# EAGLE design MicroMaster (EAGLE 9.6.2)
COMPANY: ADAFRUIT INDUSTRIES; DRAWN: KTOWN; REV: A
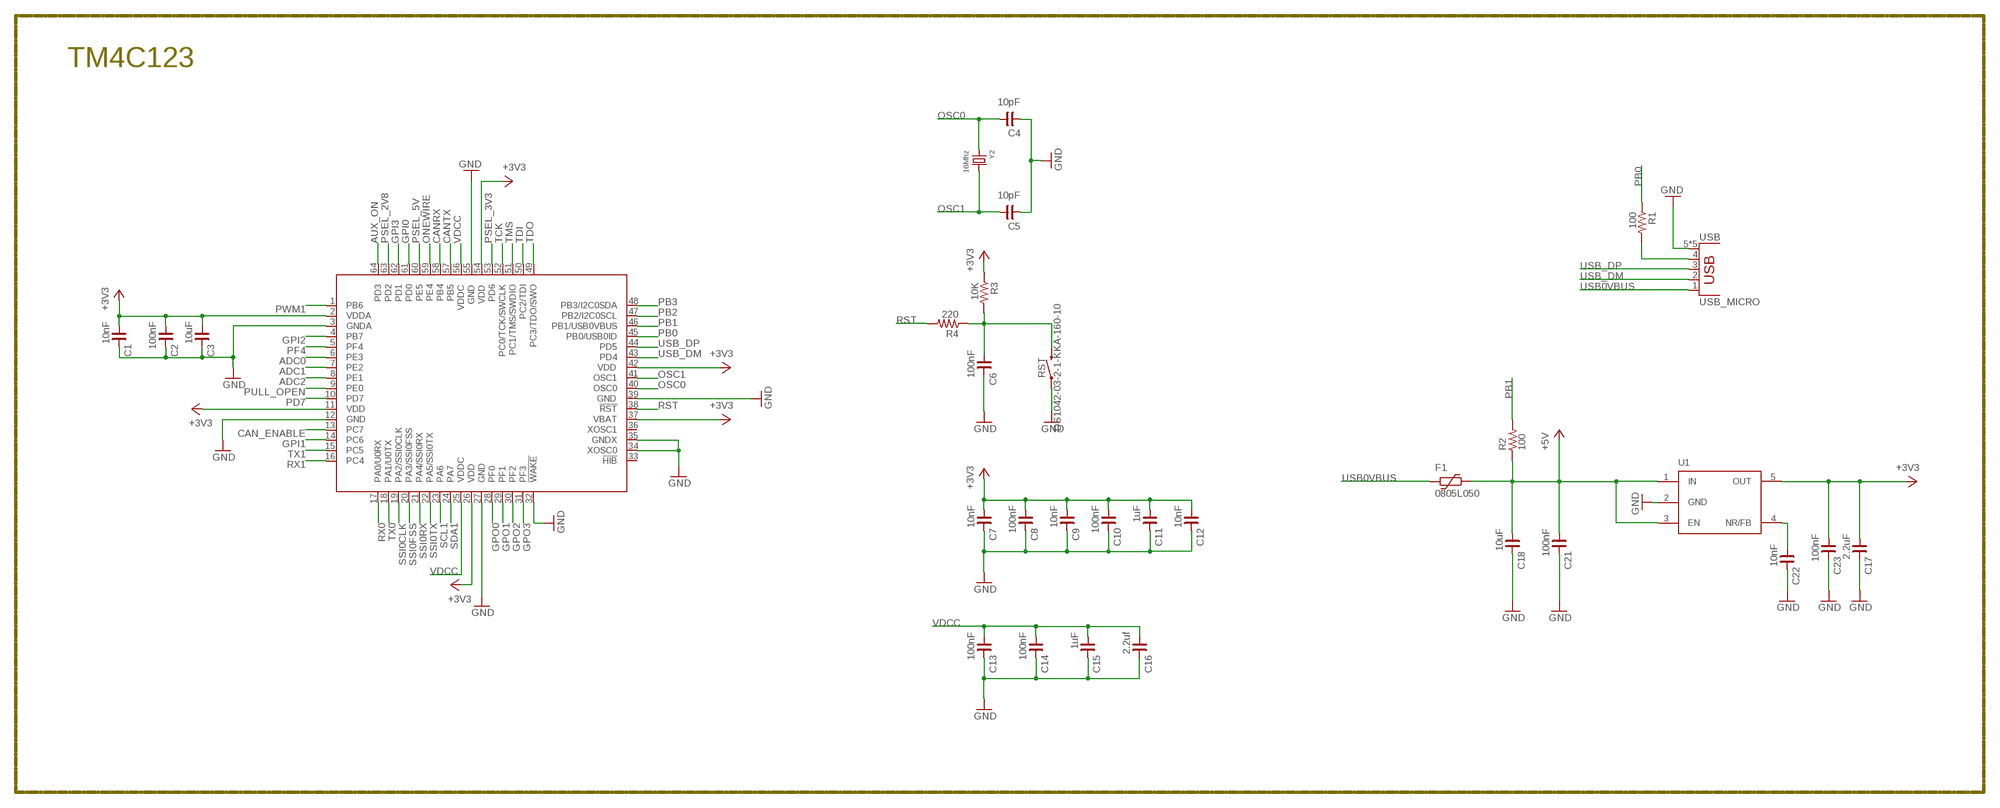
[diagram p0: schematic, sheet 1, part 1 of 3]
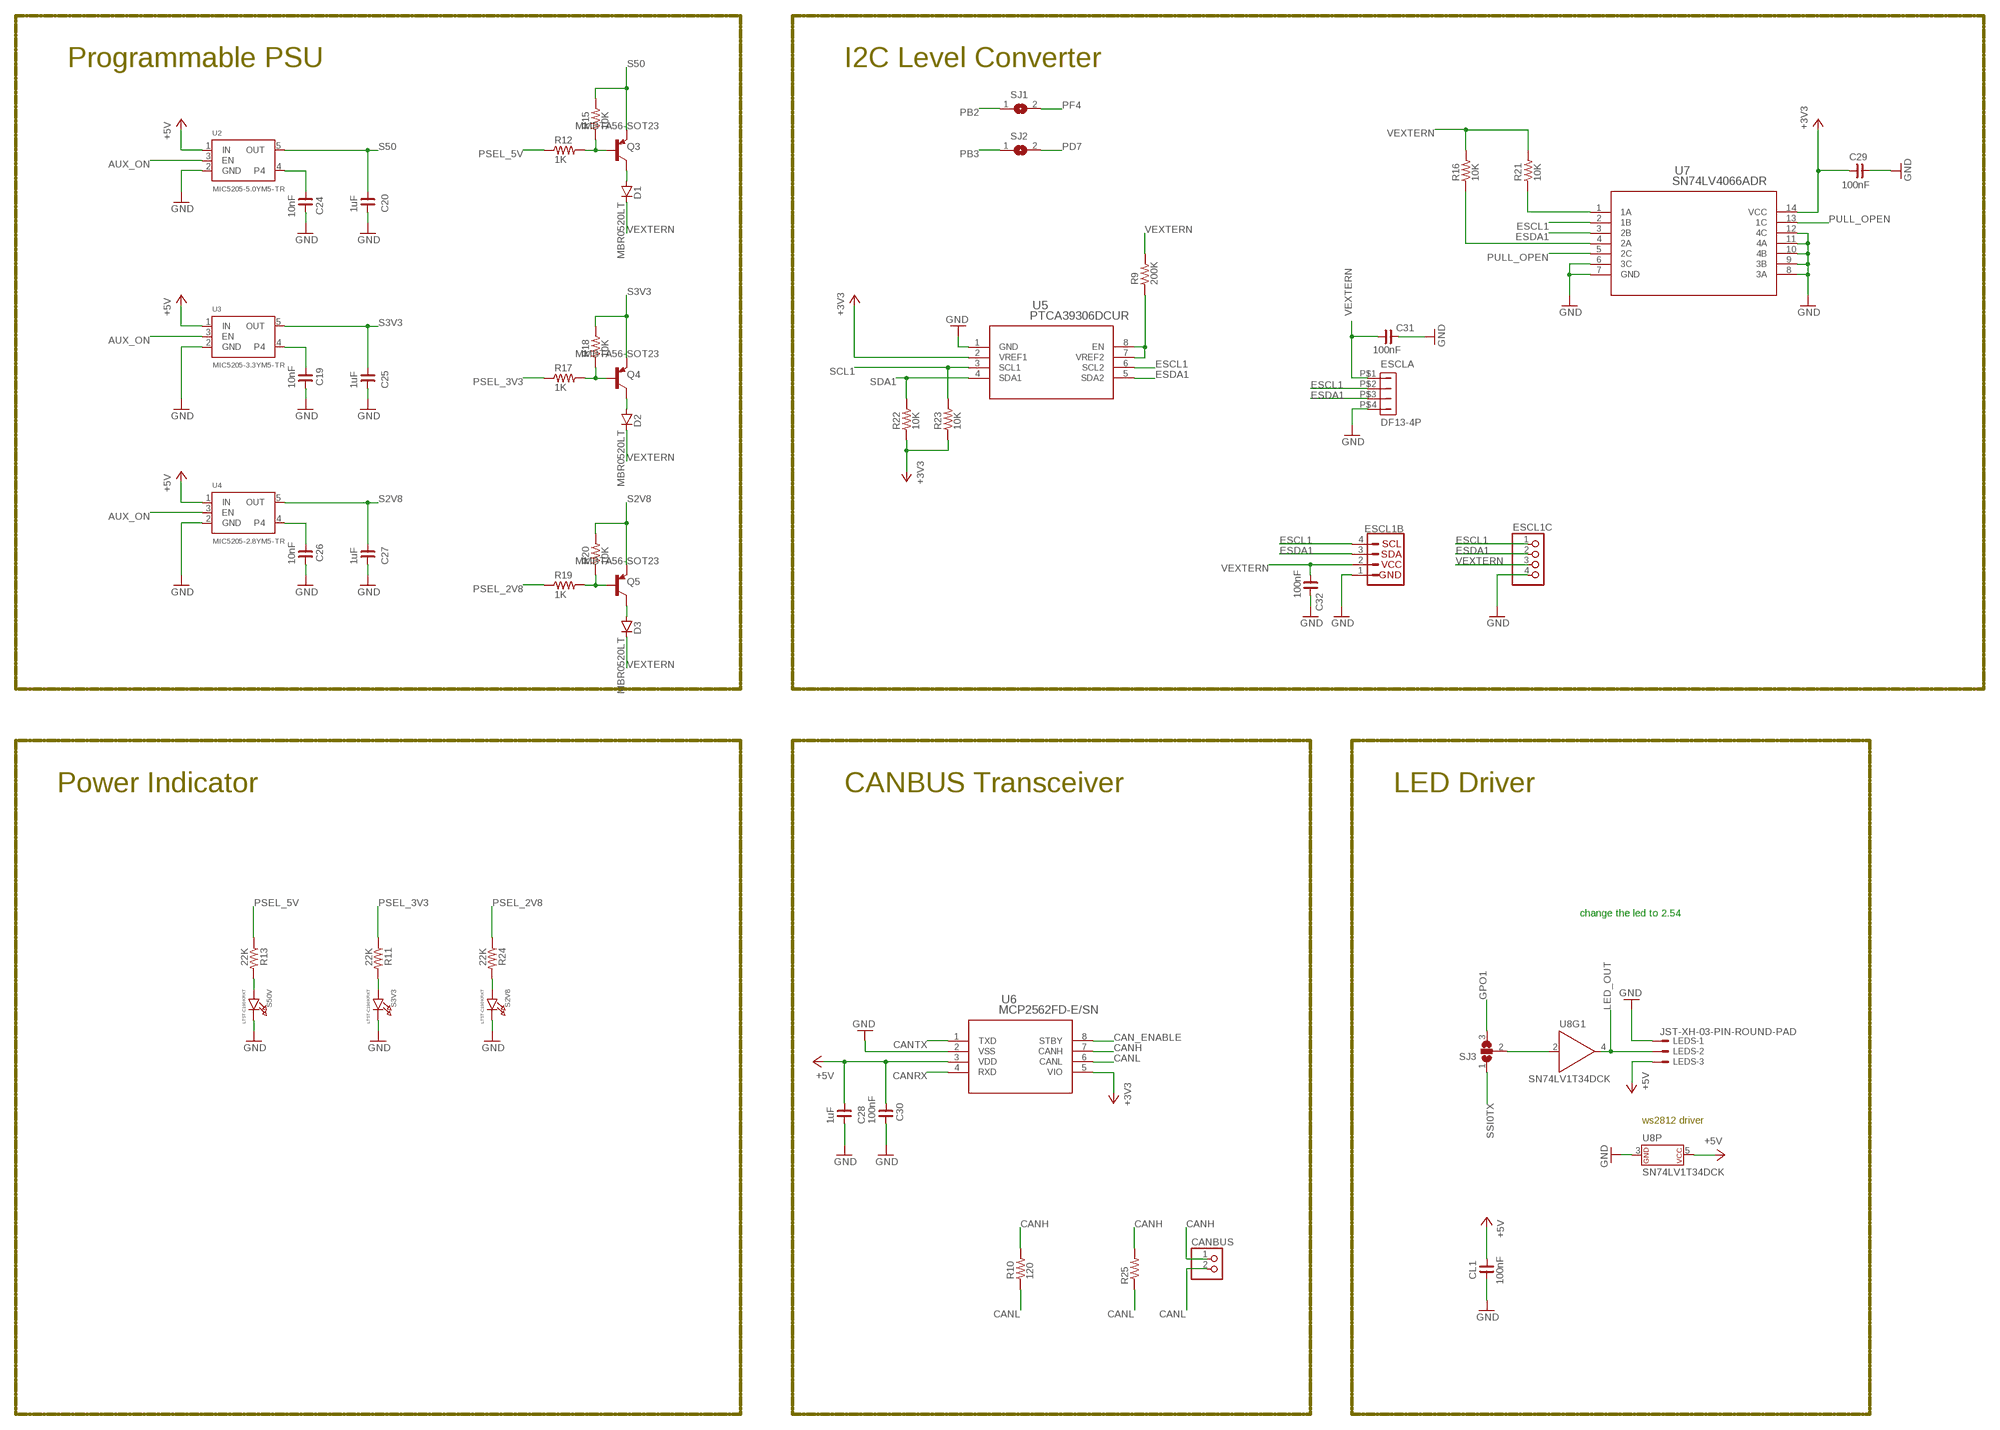
[diagram p1: schematic, sheet 1, part 2 of 3]
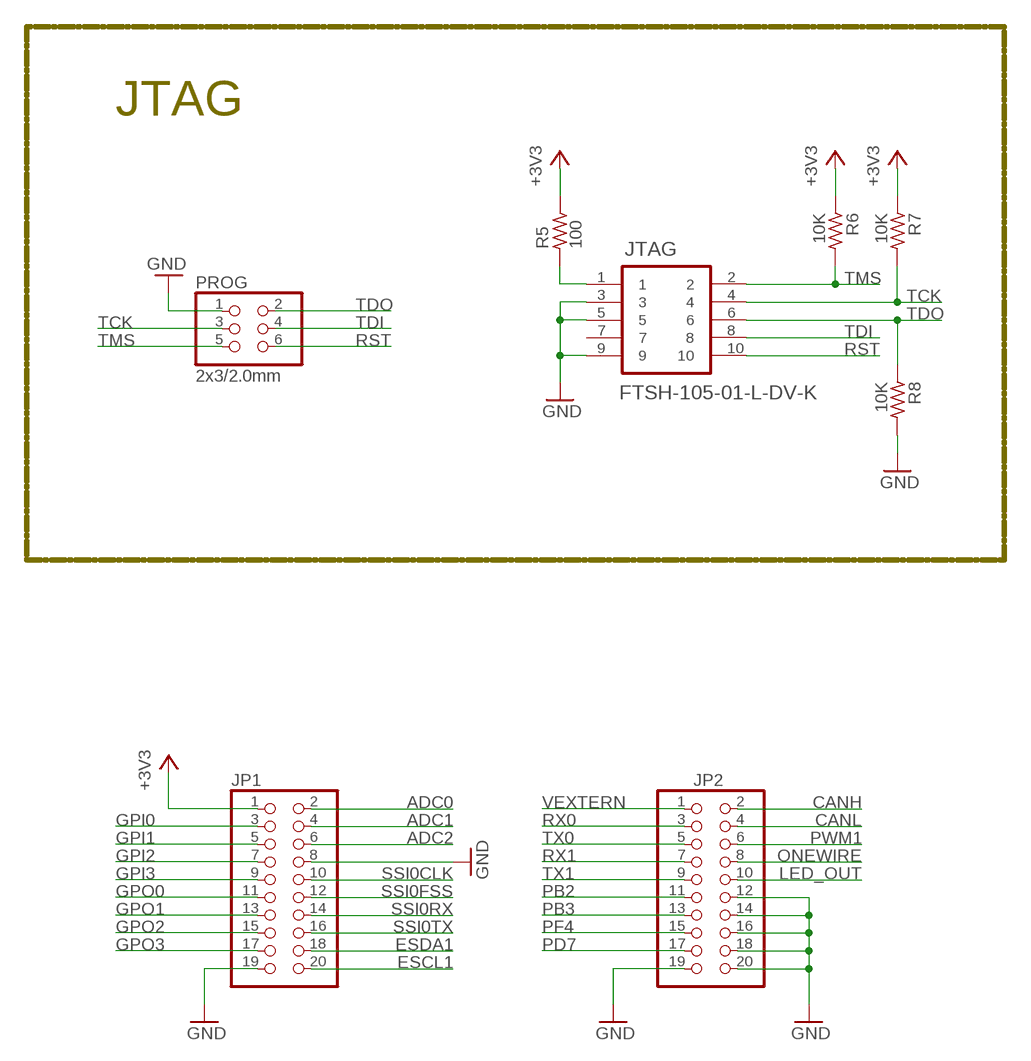
[diagram p2: schematic, sheet 1, part 3 of 3]

## Parts
C1  10nF  C_0402  [C0402]
C2  100nF  C_0402  [C0402]
C3  10uF  C_0603  [C0603]
C4  10pF  C_0402  [C0402]
C5  10pF  C_0402  [C0402]
C6  100nF  C_0402  [C0402]
C7  10nF  C_0402  [C0402]
C8  100nF  C_0402  [C0402]
C9  10nF  C_0402  [C0402]
C10  100nF  C_0402  [C0402]
C11  1uF  C_0402  [C0402]
C12  10nF  C_0402  [C0402]
C13  100nF  C_0402  [C0402]
C14  100nF  C_0402  [C0402]
C15  1uF  C_0402  [C0402]
C16  2.2uf  C_0603  [C0603]
C17  2.2uF  C_0603  [C0603]
C18  10uF  C_0603  [C0603]
C19  10nF  C_0402  [C0402]
C20  1uF  C_0603  [C0603]
C21  100nF  C_0402  [C0402]
C22  10nF  C_0402  [C0402]
C23  100nF  C_0402  [C0402]
C24  10nF  C_0402  [C0402]
C25  1uF  C_0603  [C0603]
C26  10nF  C_0402  [C0402]
C27  1uF  C_0603  [C0603]
C28  1uF  C_0805  [C0805]
C29  100nF  C_0603  [C0603]
C30  100nF  C_0603  [C0603]
C31  100nF  C_0402  [C0402]
C32  100nF  C_0402  [C0402]
CANBUS  PINHD-1X02_2.54-S  [1X02-S]
CL1  100nF  C_0402  [C0402]
D1  MBR0520LT  [SOD123]
D2  MBR0520LT  [SOD123]
D3  MBR0520LT  [SOD123]
ESCL1B  QWIIC_CONNECTORJS-1MM  [1X04_1MM_RA]
ESCL1C  PINHD-1X04_2.54-S  [1X04-S]
ESCLA  DF13-4P  DF13-4P-1.25DSA  [DF13-4P-1.25DSA]
F1  0805L050  [0805L]
IC1  TM4C123[7,G]XXPM  [PM_S-PQFP-G64]
JP1  PINHD-2X10_2.54  [2X10]
JP2  PINHD-2X10_2.54  [2X10]
JTAG  FTSH-105-01-L-DV-K  [SAMTEC_FTSH-105-01-L-DV-K]
LEDS  JST-XH-03-PIN-ROUND-PAD  [JST-XH-03-PACKAGE-ROUND-PAD]
PROG  2x3/2.0mm  PINHD-2X03_2.00  [2X03M]
Q3  MMBTA56-SOT23  [SOT23]
Q4  MMBTA56-SOT23  [SOT23]
Q5  MMBTA56-SOT23  [SOT23]
R1  100  R_0402  [R0402]
R2  100  R_0402  [R0402]
R3  10K  R_0402  [R0402]
R4  220  R_0402  [R0402]
R5  100  R_0402  [R0402]
R6  10K  R_0402  [R0402]
R7  10K  R_0402  [R0402]
R8  10K  R_0402  [R0402]
R9  200K  R_0402  [R0402]
R10  120  R_0603  [R0603]
R11  22K  R_0402  [R0402]
R12  1K  R_0402  [R0402]
R13  22K  R_0402  [R0402]
R15  10K  R_0402  [R0402]
R16  10K  R_0402  [R0402]
R17  1K  R_0402  [R0402]
R18  10K  R_0402  [R0402]
R19  1K  R_0402  [R0402]
R20  10K  R_0402  [R0402]
R21  10K  R_0402  [R0402]
R22  10K  R_0402  [R0402]
R23  10K  R_0402  [R0402]
R24  22K  R_0402  [R0402]
R25  R-US_0204/5  [0204/5]
RST  DS1042-03-2-1-KKA-160-10  DS1042-03-2-1  [DS1042-03-2-1]
S2V8  LTST-C190KRKT  LED0603  [CHIPLED_0603]
S3V3  LTST-C190KRKT  LED0603  [CHIPLED_0603]
S50V  LTST-C190KRKT  LED0603  [CHIPLED_0603]
SJ1  SOLDERJUMPERCLOSED  [SOLDERJUMPER_CLOSEDWIRE]
SJ2  SOLDERJUMPERCLOSED  [SOLDERJUMPER_CLOSEDWIRE]
SJ3  SJ2W  [SJ_2]
U1  TPS73633  [SOT23-5L]
U2  MIC5205-5.0YM5-TR  VREG_SOT23-5  [SOT23-5]
U3  MIC5205-3.3YM5-TR  VREG_SOT23-5  [SOT23-5]
U4  MIC5205-2.8YM5-TR  VREG_SOT23-5  [SOT23-5]
U5  PTCA39306DCUR  [VSSOP8_PTCA39306DCUR_TEX]
U6  MCP2562FD-E/SN  [SOIC8-N_MC_MCH]
U7  SN74LV4066ADR  [D14]
U8  SN74LV1T34DCK  [SC70-5]
USB  USB_MICRO  [USB_MICRO_MOLEX_FULL]
Y2  16Mhz  CRYSTAL.6X3.3MM  [6X3.3MM]

## Nets
+3V3: C1.1 C2.1 C3.1 C7.1 C8.1 C9.1 C10.1 C11.1 C12.1 C17.1 C23.1 C29.1 IC1.2(VDDA) IC1.11(VDD) IC1.26(VDD) IC1.37(VBAT) IC1.42(VDD) IC1.54(VDD) JP1.1 R3.1 R5.2 R6.1 R7.1 R22.1 R23.1 U1.5(OUT) U5.2(VREF1) U6.5(VIO) U7.14(VCC)
ADC0: IC1.6(PE3) JP1.2
ADC1: IC1.7(PE2) JP1.4
ADC2: IC1.8(PE1) JP1.6
AUX_ON: IC1.64(PD3) U2.3(EN) U3.3(EN) U4.3(EN)
CAN_ENABLE: IC1.13(PC7) U6.8(STBY)
CANH: CANBUS.1 JP2.2 R10.2 R25.2 U6.7(CANH)
CANL: CANBUS.2 JP2.4 R10.1 R25.1 U6.6(CANL)
CANRX: IC1.58(PB4) U6.4(RXD)
CANTX: IC1.57(PB5) U6.1(TXD)
ESCL1: ESCL1B.4 ESCL1C.1 ESCLA.P$2 JP1.20 U5.6(SCL2) U7.2(1B)
ESDA1: ESCL1B.3 ESCL1C.2 ESCLA.P$3 JP1.18 U5.5(SDA2) U7.3(2B)
GND: C1.2 C2.2 C3.2 C4.1 C5.1 C6.2 C7.2 C8.2 C9.2 C10.2 C11.2 C12.2 C13.2 C14.2 C15.2 C16.2 C17.2 C18.2 C19.2 C20.2 C21.2 C22.2 C23.2 C24.2 C25.2 C26.2 C27.2 C28.2 C29.2 C30.2 C31.2 C32.2 CL1.1 ESCL1B.1 ESCL1C.4 ESCLA.P$4 IC1.3(GNDA) IC1.12(GND) IC1.27(GND) IC1.32(!WAKE) IC1.34(XOSC0) IC1.35(GNDX) IC1.39(GND) IC1.55(GND) JP1.8 JP1.19 JP2.12 JP2.14 JP2.16 JP2.18 JP2.19 JP2.20 JTAG.3 JTAG.5 JTAG.9 LEDS.1 PROG.1 R8.2 RST.P$1 S2V8.C S3V3.C S50V.C U1.2(GND) U2.2(GND) U3.2(GND) U4.2(GND) U5.1(GND) U6.2(VSS) U7.6(3C) U7.7(GND) U7.8(3A) U7.9(3B) U7.10(4B) U7.11(4A) U7.12(4C) U8.3(P:P$V-) USB.5(GND) USB.P$1(GND) USB.P$2(GND) USB.P$3(GND) USB.P$4(GND)
GPI0: IC1.61(PD0) JP1.3
GPI1: IC1.14(PC6) JP1.5
GPI2: IC1.4(PB7) JP1.7
GPI3: IC1.62(PD1) JP1.9
GPO0: IC1.28(PF0) JP1.11
GPO1: IC1.29(PF1) JP1.13 SJ3.3
GPO2: IC1.30(PF2) JP1.15
GPO3: IC1.31(PF3) JP1.17
LED_OUT: JP2.10 LEDS.2 U8.4(Y)
N$1: C19.1 U3.4
N$2: JTAG.1 R5.1
N$4: C6.1 R3.2 R4.1 RST.P$2
N$7: R21.1 U7.1(1A)
N$8: R1.2 USB.4(ID)
N$9: R9.1 U5.7(VREF2) U5.8(EN)
N$10: R16.1 U7.4(2A)
N$11: R24.2 S2V8.A
N$12: C24.1 U2.4
N$13: R11.2 S3V3.A
N$14: C26.1 U4.4
N$15: R13.2 S50V.A
N$16: SJ3.2 U8.2(A)
N$17: C22.1 U1.4(NR/FB)
N$20: D1.A Q3.3(C)
N$21: Q3.1(B) R12.2 R15.1
N$24: D2.A Q4.3(C)
N$25: Q4.1(B) R17.2 R18.1
N$28: D3.A Q5.3(C)
N$29: Q5.1(B) R19.2 R20.1
ONEWIRE: IC1.59(PE4) JP2.8
OSC0: C4.2 IC1.40(OSC0) Y2.1
OSC1: C5.2 IC1.41(OSC1) Y2.2
PB0: IC1.45(PB0/USB0ID) R1.1
PB1: IC1.46(PB1/USB0VBUS) R2.2
PB2: IC1.47(PB2/I2C0SCL) JP2.11 SJ1.1
PB3: IC1.48(PB3/I2C0SDA) JP2.13 SJ2.1
PD7: IC1.10(PD7) JP2.17 SJ2.2
PF4: IC1.5(PF4) JP2.15 SJ1.2
PSEL_2V8: IC1.63(PD2) R19.1 R24.1
PSEL_3V3: IC1.53(PD6) R11.1 R17.1
PSEL_5V: IC1.60(PE5) R12.1 R13.1
PULL_OPEN: IC1.9(PE0) U7.5(2C) U7.13(1C)
PWM1: IC1.1(PB6) JP2.6
RST: IC1.38(!RST) JTAG.10 PROG.6 R4.2
RX0: IC1.17(PA0/U0RX) JP2.3
RX1: IC1.16(PC4) JP2.7
S2V8: C27.1 Q5.2(E) R20.2 U4.5(OUT)
S3V3: C25.1 Q4.2(E) R18.2 U3.5(OUT)
S50: C20.1 Q3.2(E) R15.2 U2.5(OUT)
SCL1: IC1.23(PA6) R23.2 U5.3(SCL1)
SDA1: IC1.24(PA7) R22.2 U5.4(SDA1)
SSI0CLK: IC1.19(PA2/SSI0CLK) JP1.10
SSI0FSS: IC1.20(PA3/SSI0FSS) JP1.12
SSI0RX: IC1.21(PA4/SSI0RX) JP1.14
SSI0TX: IC1.22(PA5/SSI0TX) JP1.16 SJ3.1
TCK: IC1.52(PC0/TCK/SWCLK) JTAG.4 PROG.3 R7.2
TDI: IC1.50(PC2/TDI) JTAG.8 PROG.4
TDO: IC1.49(PC3/TDO/SWO) JTAG.6 PROG.2 R8.1
TMS: IC1.51(PC1/TMS/SWDIO) JTAG.2 PROG.5 R6.2
TX0: IC1.18(PA1/U0TX) JP2.5
TX1: IC1.15(PC5) JP2.9
USB0VBUS: F1.2 USB.1(VBUS)
USB05V: C18.1 C21.1 C28.1 C30.1 CL1.2 F1.1 LEDS.3 R2.1 U1.1(IN) U1.3(EN) U2.1(IN) U3.1(IN) U4.1(IN) U6.3(VDD) U8.5(P:P$V+) ; supply symbol labelled +5V
USB_DM: IC1.43(PD4) USB.2(D-)
USB_DP: IC1.44(PD5) USB.3(D+)
VDCC: C13.1 C14.1 C15.1 C16.1 IC1.25(VDDC) IC1.56(VDDC)
VEXTERN: C31.1 C32.1 D1.C D2.C D3.C ESCL1B.2 ESCL1C.3 ESCLA.P$1 JP2.1 R9.2 R16.2 R21.2
Unconnected: IC1.33(!HIB) IC1.36(XOSC1) JTAG.7

## Notes on the sheet
- TM4C123 | JTAG
- Programmable PSU | I2C Level Converter
- Power Indicator | CANBUS Transceiver | LED Driver
- change the led to 2.54
- ws2812 driver

## Library data of the parts
C1-C32 CL1 = rc-master-smd:C_: NON-POLARIZED CAP
CANBUS = pinhead-2:PINHD-1X02: PIN HEADER
D1-D3 = diode:MBR0520LT: SCHOTTKY BARRIER RECTIFIER Source: http://onsemi.com .. MBR0520LT1-D.pdf
ESCL1B = SparkFun-Connectors:QWIIC_CONNECTOR: SparkFun I2C Standard Qwiic Connector An SMD 1mm pitch JST connector makes it easy and quick (get it? Qwiic?) to connect I2C devices to each other. The Qwiic system <http://www.sparkfun.com/qwiic> enables fast and solderless connection between popular platforms and various sensors and actuators. We carry 200mm <https://www.sparkfun.com/products/14204>, 100mm <https://www.sparkfun.com/products/14205>, 50mm <https://www.sparkfun.com/products/14206>, and breadboard friendly <https://www.sparkfun.com/products/14207> Qwiic cables. We also offer 10 pcs strips <https://www.sparkfun.com/products/14323> the SMD connectors.; PROD_ID: CONN-13694
ESCL1C = pinhead-2:PINHD-1X04: PIN HEADER
ESCLA = con-hirose-df13:DF13-4P-1.25: DF13-4P 1.25mm Pitch Miniature Crimping Connector.
F1 = polyfuse-smd_10:?: Polyfuse Resettable PTC Source: http://www.littelfuse.com/products/resettable-ptcs.aspx; MF: Littelfuse; MPN: 0805L050; OC_FARNELL: 1832103; OC_NEWARK: 18M4776
IC1 = ti-tiva:TM4C123[7,G]XX
JP1 JP2 = pinhead-2:PINHD-2X10: PIN HEADER
JTAG = FTSH-105-01-L-DV-K:FTSH-105-01-L-DV-K: CONN HEADER, 1.27MM, 2X5WAY, SMT; AVAILABILITY: Good; DESCRIPTION: Conn Unshrouded Header HDR 10 POS 1.27mm Solder ST SMD Automotive Tube; MF: Samtec; MP: FTSH-105-01-L-DV-K; PACKAGE: TSSOP-20 Texas Instruments; PRICE: 1.93 USD
LEDS = jst_xh:JST-XH-03-PIN: JST XH Connector 2 Pin Wire to board connector. Pitch: 2,54 mm, (0.100") Number of pins: 3 Created by Rembrandt Electronics www.rembrandtelectronics.com
PROG = pinhead-2:PINHD-2X03: PIN HEADER
Q3-Q5 = transistor-pnp:*-?: PNP Transistor
R1-R13 R15-R24 = rc-master-smd:R_: RESISTOR
R25 = rcl:R-US_: RESISTOR, American symbol; SPICEPREFIX: R
RST = EAGLE_CAN:DS1042-03-2-1
S2V8 S3V3 S50V = microbuilder:LED: LED 0603 - 0603 Surface Mount Package 2mA: Green LED - Low Power (3.9mcd, 2ma, 1.7Vf) - Digikey: 475-2709-2-ND Orange LED - Low Power (9.8mcd, 2ma, 1.8Vf) - Digikey: 475-1194-2-ND Red LED - Low Power (5mcd, 2ma, 1.8Vf) - Digikey: 475-1195-2-ND Yellow LED - Low Power (7mcd, 2ma, 1.8Vf) - Digikey: 475-1196-2-ND 5mA: Blue LED - Low Power (17mcd, 5ma, 2.9Vf) - Digikey: LNJ937W8CRACT-ND 0805 - 0805 Surface Mount Package 2mA: Red LED (8.8mcd, 2mA, 1.8Vf, Clear) - Low Power [Digikey: 475-2510-1-ND] Green LED (5mcd, 2mA, 1.8Vf, Clear) - Low Power [Digikey: 475-2730-1-ND] Yellow LED (11.3mcd, 2mA, 1.8Vf, Clear) - Low Power [Digikey: 475-2555-1-ND] 20mA: Red LED (104mcd, 20mA, Diffused) - LS R976 [Digikey: 475-1278-6-ND] Red LED (12mcd, 20mA, 2.0Vf, Clear) - APT2012EC [Digikey: 754-1128-1-ND] Green LED (15mcd, 20mA, 2.2Vf, Clear) - APT2012GC [Digikey: 754-1131-1-ND] Orange LED (160mcd, 20mA, 2.1Vf, Clear) - APT2012SECK [Digikey: 754-1130-1-ND] 1206 - 1206 Surface Mount Package Green LED (26mcd, 20mA, Diffused) - LG N971 [Digikey: 475-1407-6-ND] Red LED (15mcd, 20mA, Diffused) - LH N974 [Digikey: 475-1416-6-ND]
SJ1 SJ2 = microbuilder:SOLDERJUMPER: SMD Solder JUMPER Solder the two pads together to create a connection, or remove the solder to break it. REFLOW - Use this footprint for solder paste and reflow ovens. WAVE - Use this footprint for hand-soldering (larger pads). CLOSED - Has a trace between the two pads to ensure it is closed by default. The trace needs to be cut to disable the jumper, and can be closed again by creating a solder bridge between the two pads.
SJ3 = jumper:SJ2W: SMD solder JUMPER
U1 = tpslib:TPS73633
U2-U4 = microbuilder:VREG_SOT23-5: SOT23-5 Fixed Voltage Regulators To better organise some of the SOT23-5 fixed voltage regulators in this library, this new part was created. Part Current Out V Out V In V Dropout Digikey Part No. ADP121 150mA 3.3V 3.4-5.5V 0.09V @ 150mA ADP121-AUJZ33R7CT-ND ADP121 150mA 3.0V 3.1-5.5V 0.09V @ 150mA ADP121-AUJZ30R7CT-ND ADP122 300mA 3.3V 3.4-5.5V 0.085V @ 300mA ADP122AUJZ-3.3-R7CT-ND ADP1712 300mA 3.3V 3.5-5.5V 0.17V @ 300mA ADP1712AUJZ-3.3-R7TR-ND AP7311 (Low Cost) 150mA 3.3V 3.5-6V 0.15V @ 150mA AP7311-33WG-7DICT-ND LD39015M18R 150mA 1.8V 1.9V-5.5V 0.08V @ 100mA 497-6977-1-ND MCP1824T-3302E/OT 300mA 3.3V 3.5V-6V 0.2V @ 300mA MCP1824T-3302E/OTCT-ND MIC5205-2.5YM5 TR 150mA 2.5V 2.7-16V 0.165V @ 150mA 576-1257-2-ND MIC5205-3.0YM5 TR 150mA 3.0V 3.2V-16V 0.165V @ 150mA 576-1258-2-ND MIC5205-3.3YM5 TR 150mA 3.3V 3.5V-16V 0.165V @ 150mA 576-1259-2-ND TPS780330220 150mA 3.3V+2.2V 3.6-5.5V 250mV Max 296-23332-1-ND TDA3663/N1,135 100mA 3.3V 3.5-45V 0.18V @ 50mA 568-5343-1-ND
U5 = PTCA39306:PTCA39306DCUR; COPYRIGHT: Copyright (C) 2021 Ultra Librarian. All rights reserved.; MANUFACTURER_PART_NUMBER: PTCA39306DCUR; MFR_NAME: Texas Instruments
U6 = mcp2562:MCP2562FD-E/SN; COPYRIGHT: Copyright (C) 2021 Ultra Librarian. All rights reserved.; MANUFACTURER_PART_NUMBER: MCP2562FD-E/SN; MFR_NAME: Microchip
U7 = SN74LV4066ADR:SN74LV4066ADR; COPYRIGHT: Copyright (C) 2021 Ultra Librarian. All rights reserved.; MANUFACTURER_PART_NUMBER: SN74LV4066ADR; MFR_NAME: Texas Instruments
U8 = greg-IC:SN74LV1T34: Single Power Supply Single Buffer GATE CMOS Logic Level Shifter Texas Instruments SN74LV1T34 The SN74LV1T34 device is a low voltage CMOS gate logic that operates at a wider voltage range for industrial, portable, and telecom applications. The output level is referenced to the supply voltage and is able to support 1.8-V, 2.5-V, 3.3-V, and 5-V CMOS levels. The input is designed with a lower threshold circuit to match 1.8 V input logic at VCC = 3.3 V and can be used in 1.8 V to 3.3 V level up translation. In addition, the 5 V tolerant input pins enable down translation (that is, 3.3 V to 2.5 V output at VCC = 2.5 V). The wide VCC range of 1.8 V to 5.5 V allows generation of desired output levels to connect to controllers or processors. The SN74LV1T34 device is designed with currentdrive capability of 8 mA to reduce line reflections, overshoot, and undershoot caused by high-drive outputs. SN74LV1T34 Datasheet <http://www.ti.com/lit/ds/symlink/sn74lv1t34.pdf>
USB = FLYTRON:USB_MICRO
Y2 = abracon:CRYSTAL

## Board
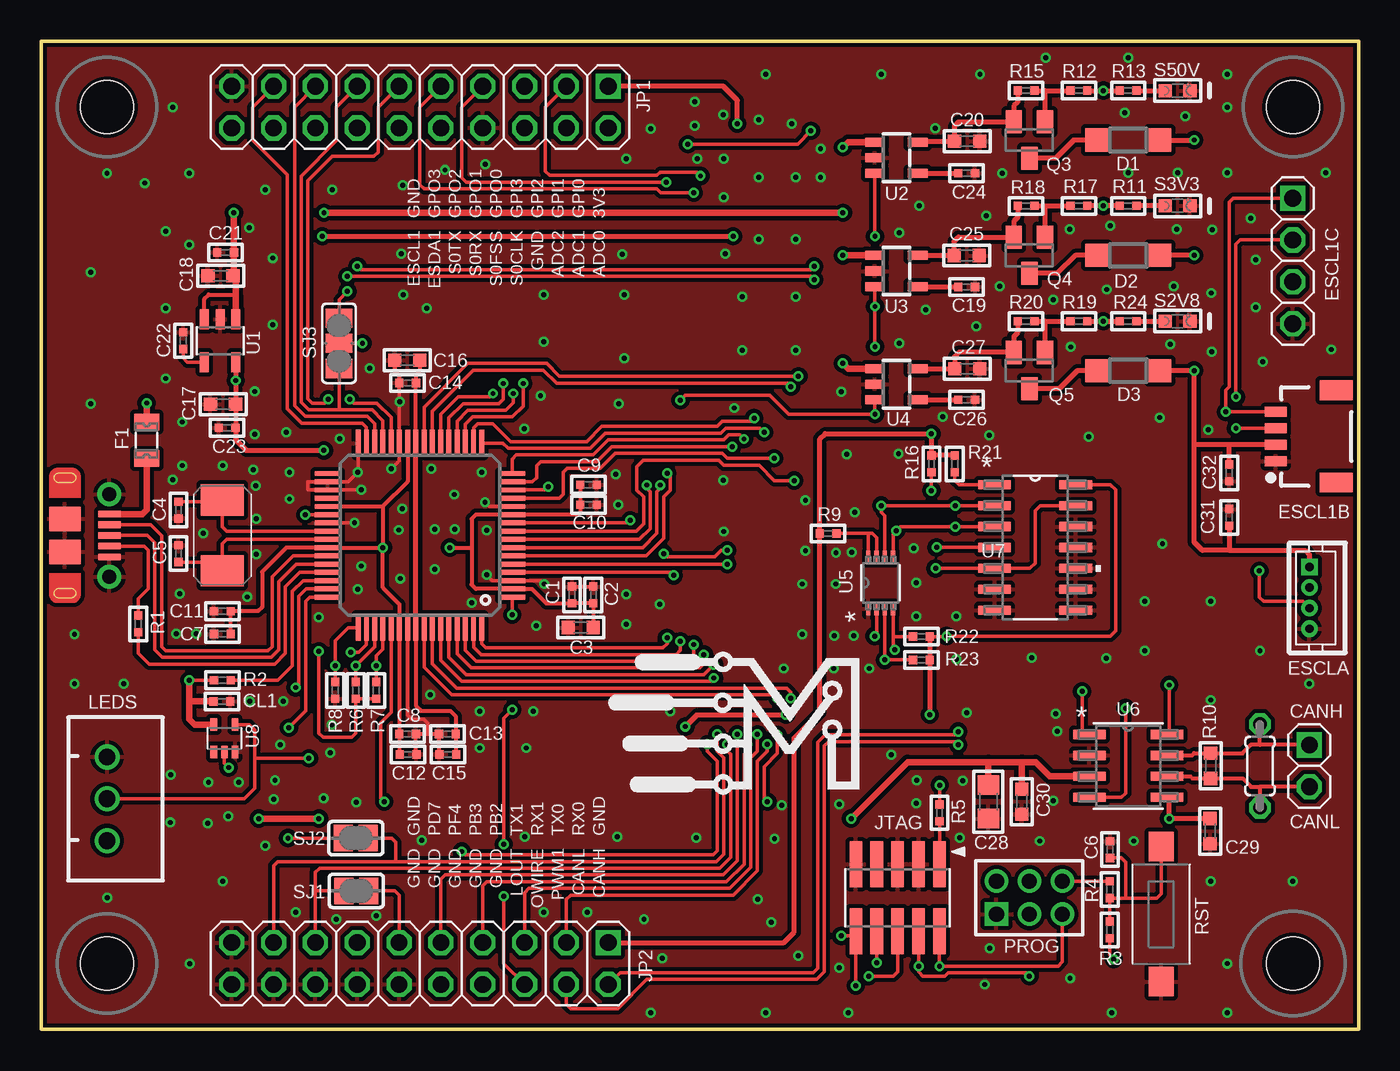
[diagram p3: board, top side]
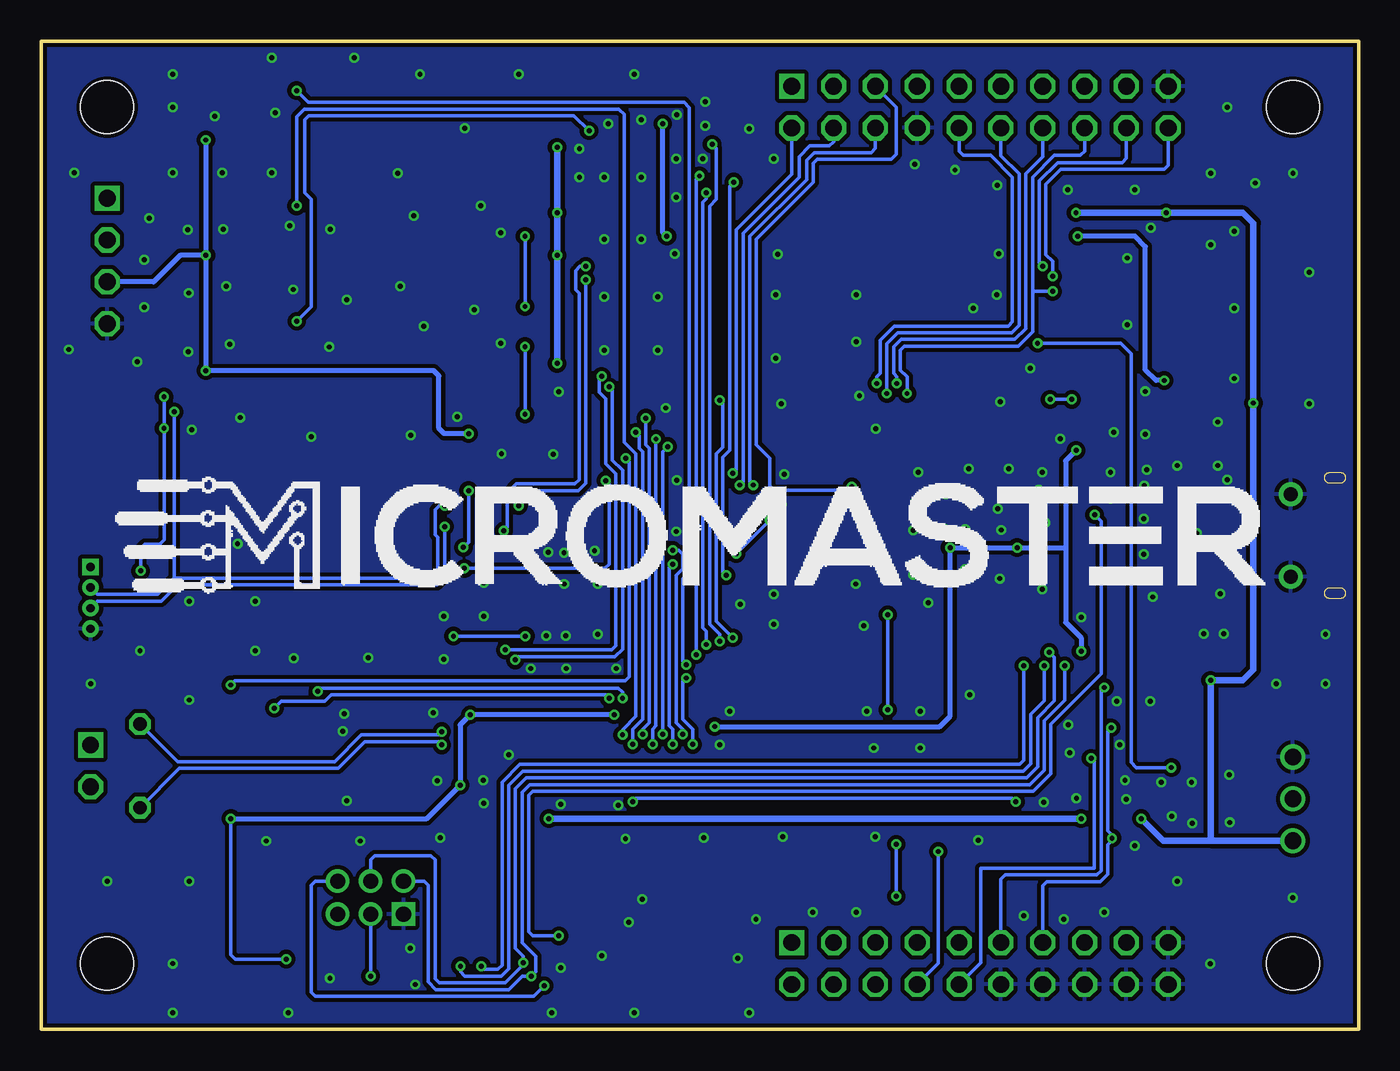
[diagram p4: board, bottom side, seen from below]

Size 80 x 60 mm. Coordinates in mm from the lower left corner, seen from the top.
Outline: 80,0 0,0 0,60 80,60 80,0
Copper layers (1*16): Top 0.035mm / dielectric 1.5mm / Bottom 0.035mm
Design rules "SeeedStudio_2layer_DRU_no_angle_20140221 *": minimum track width 6mil, minimum drill 11mil, track to track 6mil, track to pad 6mil, pad to pad 6mil, via to via 6mil, smd to smd 0mil, copper to edge 10mil, drill to drill 10mil, minimum pad ring 10mil, minimum via ring 6mil, stop-mask expansion 2mil, vias tented up to drill 12mil, thermal gap 10mil
Holes 3.2 mm at 4,4 76,4 76,56 4,56

### Footprints (pad centres in the part's own frame; a part is rotated, then mirrored left to right if it is on the bottom)
C0402 = smd 0.5 x 0.5: 1 -0.508,0; 2 0.508,0
C0603 = smd 0.8 x 0.8: 1 -0.762,0; 2 0.762,0
C0805 = smd 1.2 x 1.3: 1 -1.016,0; 2 1.016,0
1X02-S = drill 1.016 square: 1 -1.27,0 | drill 1.016 octagon: 2 1.27,0
SOD123 = smd 1.4 x 1.4: A 1.9,0; C -1.9,0
1X04_1MM_RA = smd 0.6 x 1.35: 1 -1.5,0; 2 -0.5,0; 3 0.5,0; 4 1.5,0 | smd 1.2 x 2: NC1 2.8,-3.675; NC2 -2.8,-3.675
1X04-S = drill 1.016 square: 1 -3.81,0 | drill 1.016 octagon: 2 -1.27,0; 3 1.27,0; 4 3.81,0
DF13-4P-1.25DSA = drill 0.5 pad 0.95 square: P$1 1.875,0 | drill 0.5 pad 0.95: P$2 0.625,0; P$3 -0.625,0; P$4 -1.875,0
0805L = smd 1 x 1.5: 1 -1.1,0; 2 1.1,0
PM_S-PQFP-G64 = smd 1.6 x 0.3: 1 -5.6,3.75; 2 -5.6,3.25; 3 -5.6,2.75; 4 -5.6,2.25; 5 -5.6,1.75; 6 -5.6,1.25; 7 -5.6,0.75; 8 -5.6,0.25; 9 -5.6,-0.25; 10 -5.6,-0.75; 11 -5.6,-1.25; 12 -5.6,-1.75; 13 -5.6,-2.25; 14 -5.6,-2.75; 15 -5.6,-3.25; 16 -5.6,-3.75; 33 5.6,-3.75; 34 5.6,-3.25; 35 5.6,-2.75; 36 5.6,-2.25; 37 5.6,-1.75; 38 5.6,-1.25; 39 5.6,-0.75; 40 5.6,-0.25; 41 5.6,0.25; 42 5.6,0.75; 43 5.6,1.25; 44 5.6,1.75; 45 5.6,2.25; 46 5.6,2.75; 47 5.6,3.25; 48 5.6,3.75 | smd 0.3 x 1.6: 17 -3.75,-5.6; 18 -3.25,-5.6; 19 -2.75,-5.6; 20 -2.25,-5.6; 21 -1.75,-5.6; 22 -1.25,-5.6; 23 -0.75,-5.6; 24 -0.25,-5.6; 25 0.25,-5.6; 26 0.75,-5.6; 27 1.25,-5.6; 28 1.75,-5.6; 29 2.25,-5.6; 30 2.75,-5.6; 31 3.25,-5.6; 32 3.75,-5.6; 49 3.75,5.6; 50 3.25,5.6; 51 2.75,5.6; 52 2.25,5.6; 53 1.75,5.6; 54 1.25,5.6; 55 0.75,5.6; 56 0.25,5.6; 57 -0.25,5.6; 58 -0.75,5.6; 59 -1.25,5.6; 60 -1.75,5.6; 61 -2.25,5.6; 62 -2.75,5.6; 63 -3.25,5.6; 64 -3.75,5.6
2X10 = drill 1.016 square: 1 -11.43,-1.27 | drill 1.016 octagon: 2 -11.43,1.27; 3 -8.89,-1.27; 4 -8.89,1.27; 5 -6.35,-1.27; 6 -6.35,1.27; 7 -3.81,-1.27; 8 -3.81,1.27; 9 -1.27,-1.27; 10 -1.27,1.27; 11 1.27,-1.27; 12 1.27,1.27; 13 3.81,-1.27; 14 3.81,1.27; 15 6.35,-1.27; 16 6.35,1.27; 17 8.89,-1.27; 18 8.89,1.27; 19 11.43,-1.27; 20 11.43,1.27
SAMTEC_FTSH-105-01-L-DV-K = smd 0.762 x 2.794: 1 -2.54,-2.032; 2 -2.54,2.032; 3 -1.27,-2.032; 4 -1.27,2.032; 5 0,-2.032; 6 0,2.032; 7 1.27,-2.032; 8 1.27,2.032; 9 2.54,-2.032; 10 2.54,2.032
JST-XH-03-PACKAGE-ROUND-PAD = drill 1.016: 1 -2.54,0; 2 0,0; 3 2.54,0
2X03M = drill 0.914 square: 1 -2,-1 | drill 0.914: 2 -2,1; 3 0,-1; 4 0,1; 5 2,-1; 6 2,1
SOT23 = smd 1 x 1.4: 1 -0.95,-1.1; 2 0.95,-1.1; 3 0,1.1
R0402 = smd 0.5 x 0.5: 1 -0.508,0; 2 0.508,0
R0603 = smd 0.8 x 0.8: 1 -0.762,0; 2 0.762,0
0204/5 = drill 0.813 octagon: 1 -2.54,0; 2 2.54,0
DS1042-03-2-1 = smd 1.5 x 1.8: P$1 0,4.1; P$2 0,-4.1
CHIPLED_0603 = smd 0.8 x 0.8: A 0,-0.75; C 0,0.75
SOLDERJUMPER_CLOSEDWIRE = smd 1.168 x 1.6: 1 -0.762,0; 2 0.762,0 | smd 0.635 x 0.203: WIRE 0,0
SJ_2 = smd 1.168 x 1.6: 1 -1.524,0; 2 0,0; 3 1.524,0
SOT23-5L = smd 0.55 x 1.2: 1 -0.95,-1.3; 2 0,-1.3; 3 0.95,-1.3; 4 0.95,1.3; 5 -0.95,1.3
SOT23-5 = smd 0.55 x 1.2: 1 -0.95,-1.3; 2 0,-1.3; 3 0.95,-1.3; 4 0.95,1.3; 5 -0.95,1.3
VSSOP8_PTCA39306DCUR_TEX = smd 0.762 x 0.254: 1 -1.575,0.75; 2 -1.575,0.25; 3 -1.575,-0.25; 4 -1.575,-0.75; 5 1.575,-0.75; 6 1.575,-0.25; 7 1.575,0.25; 8 1.575,0.75
SOIC8-N_MC_MCH = smd 1.981 x 0.559: 1 -2.362,1.905; 2 -2.362,0.635; 3 -2.362,-0.635; 4 -2.362,-1.905; 5 2.362,-1.905; 6 2.362,-0.635; 7 2.362,0.635; 8 2.362,1.905
D14 = smd 1.981 x 0.559: 1 -2.464,3.81; 2 -2.464,2.54; 3 -2.464,1.27; 4 -2.464,0; 5 -2.464,-1.27; 6 -2.464,-2.54; 7 -2.464,-3.81; 8 2.464,-3.81; 9 2.464,-2.54; 10 2.464,-1.27; 11 2.464,0; 12 2.464,1.27; 13 2.464,2.54; 14 2.464,3.81
SC70-5 = smd 0.4 x 0.75: 1 -0.65,-0.825; 2 0,-0.825; 3 0.65,-0.825; 4 0.65,0.825; 5 -0.65,0.825
USB_MICRO_MOLEX_FULL = smd 0.4 x 1.35: 1 -1.29,2.644; 2 -0.64,2.644; 3 0.01,2.644; 4 0.66,2.644; 5 1.31,2.644 | drill 0.85 pad 1.45: P$1 -2.49,2.644; P$2 2.51,2.644 | smd 1.5 x 1.9: P$3 1.01,-0.056; P$4 -0.99,-0.056
6X3.3MM = smd 1.9 x 2.6: 1 -2.15,0; 2 2.15,0

### Placement (x,y rotation side)
C1  32.23,26.38 90 top
C2  33.53,26.38 90 top
C3  32.76,24.4 180 top
C4  8.33,31.53 90 top
C5  8.33,28.89 270 top
C6  64.9,10.92 90 top
C7  11,24 180 top
C8  22.25,17.94 0 top
C9  33.23,33.08 0 top
C10  33.23,31.86 0 top
C11  11,25.39 180 top
C12  22.27,16.69 0 top
C13  24.66,17.94 180 top
C14  22.25,39.25 180 top
C15  24.69,16.69 180 top
C16  22.23,40.62 180 top
C17  11.04,37.95 180 top
C18  10.89,45.75 180 top
C19  56.19,45.08 0 top
C20  56.22,53.92 0 top
C21  11.19,47.17 180 top
C22  8.63,41.81 90 top
C23  11.29,36.53 180 top
C24  56.19,51.97 0 top
C25  56.19,46.99 0 top
C26  56.19,38.23 0 top
C27  56.22,40.12 0 top
C28  57.51,13.82 270 top
C29  70.97,12.04 270 top
C30  59.54,13.82 270 top
C31  72.13,31.09 90 top
C32  72.14,33.8 270 top
CANBUS  77,16 270 top
CL1  10.97,19.91 180 top
D1  66,54 180 top
D2  66,47 180 top
D3  66,40 180 top
ESCL1B  74.95,36 90 top
ESCL1C  75.99,46.66 270 top
ESCLA  77,26.2 90 top
F1  6.4,35.77 270 top
IC1  23,30 180 top
JP1  23,56 180 top
JP2  23,4 180 top
JTAG  52,8 180 top
LEDS  4,14 270 top
PROG  60,8 0 top
Q3  60,54 180 top
Q4  60,47 180 top
Q5  60,40 180 top
R1  5.89,24.62 90 top
R2  11,21.2 0 top
R3  64.87,6.05 90 top
R4  64.87,8.48 90 top
R5  54.54,13.15 90 top
R6  19.1,20.58 90 top
R7  20.35,20.58 90 top
R8  17.86,20.58 270 top
R9  47.78,30.11 180 top
R10  71,16 90 top
R11  66,50 0 top
R12  63,57 180 top
R13  66,57 0 top
R15  59.8,57 180 top
R16  54.05,34.34 90 top
R17  63,50 180 top
R18  59.8,50 180 top
R19  63,43 180 top
R20  59.8,43 180 top
R21  55.47,34.34 90 top
R22  53.44,23.85 180 top
R23  53.44,22.43 180 top
R24  66,43 0 top
R25  74,16 90 top
RST  68,7 180 top
S2V8  69,43 270 top
S3V3  69,50 270 top
S50V  69,57 270 top
SJ1  19.13,8.41 180 top
SJ2  19.1,11.61 0 top
SJ3  18.08,41.66 270 top
U1  10.86,41.81 180 top
U2  51.92,52.92 270 top
U3  51.92,46.05 270 top
U4  51.92,39.17 270 top
U5  50.97,27.11 90 top
U6  66,16 0 top
U7  60.35,29.26 0 top
U8  11.13,17.68 0 top
USB  1.5,30 270 top
Y2  11,30 270 top

### Tracks (layer width: path | path; a pad name or v marks a point on that pad's centre or on a via)
+3V3  (via drill 0.3)
  Top 0.203: 11.81,37.96 11.81,37.95 C17.1 | R7.1 R6.1 19.1,17.98 18.85,17.73 17.12,17.73 16.87,17.98 v16.87,22.96 | v54.56,14.83 54.56,13.68 R5.2 | U5.2 50.72,24 v50.6,23.88 | R22.1 54.94,23.85 v54.97,23.88 64.91,23.88 65.23,24.19 65.23,32.75 64.91,33.07 U7.14 | R3.1 64.87,4.52 v65.13,4.27
  Top 0.254: IC1.26 22.25,33.25 20.75,31.75 | v20.75,29.25 20.75,26.82 21.75,25.81 IC1.54 C8.1 21.74,16.69 C12.1 | IC1.37 20.75,31.75 | 20.75,31.75 v20.75,29.25 | v20.75,29.25 IC1.42 14.88,29.25 13.41,27.78 13.41,25.64 13.16,25.39 C11.1 C7.1 | 26.13,29.25 26.13,31 26.39,31.25 IC1.11 32.59,31.25 32.72,31.38 C10.1 C9.1 | 26.13,29.25 26.13,27 26.39,26.75 IC1.2 29.79,26.75 30.67,25.87 C1.1 C2.1 C3.1 | v24.81,29.25 26.13,29.25
  Top 0.305: U1.5 v11.81,39.4 11.81,37.96 | 11.81,37.76 11.81,36.54 | R22.1 R23.1 v53.95,19.1 | C23.1 11.8,35.79 12.44,35.15 v17.17,35.15 | v39.12,18.39 39.83,19.1 v45.21,19.1 | v17.07,48.16 v42.01,48.16 | v42.27,54.98 42.27,56.41 41.4,57.27 JP1.1 | U6.5 68.48,13.98 v68.48,12.8 C29.1
  Top 0.406: 11.81,37.76 C17.1 | 11.81,36.54 C23.1
  Bottom 0.203: v50.6,23.88 v54.97,23.88 | v65.13,4.27 68.22,4.27 68.48,4.52 v68.48,12.8
  Bottom 0.305: 17.8,29.25 v20.75,29.25 v24.81,29.25 24.81,19.02 25.45,18.39 v39.12,18.39 | 17.8,29.25 17.8,34.52 v17.17,35.15 | v45.21,19.1 v53.95,19.1 54.56,18.49 v54.56,14.83 56.59,12.8 v68.48,12.8 | v11.81,39.4 12.32,39.4 12.95,40.03 12.95,47.52 13.59,48.16 v17.07,48.16 | v42.01,48.16 42.27,48.41 v42.27,54.98 | 17.8,29.25 17.8,24.71 16.87,23.77 v16.87,22.96
ADC0  (via drill 0.3)
  Top 0.203: IC1.6 36.73,28.75 37.8,29.82 37.8,32.34 38.2,32.75 38.2,33.56 v38,33.76
  Bottom 0.203: v38,33.76 37.8,33.97 37.8,48.55 34.43,51.91 JP1.2
ADC1  (via drill 0.3)
  Top 0.203: IC1.7 36.52,29.25 37.39,30.11 37.39,32.65 37.59,32.85 v37.59,33.05
  Bottom 0.203: v37.59,33.05 37.39,33.26 37.39,48.35 33.98,51.75 33.98,52.98 33.33,53.65 32.14,53.65 31.89,53.9 JP1.4
ADC2  (via drill 0.3)
  Top 0.203: IC1.8 36.32,29.75 36.98,30.41 36.98,32.65 36.78,32.85 v36.78,33.05
  Bottom 0.203: v36.78,33.05 36.98,33.26 36.98,48.14 33.53,51.6 33.53,52.78 33.07,53.24 29.6,53.24 29.35,53.49 JP1.6
AUX_ON  (via drill 0.3)
  Top 0.203: U2.3 v50.62,48.16 | U3.3 v50.62,43.89 v50.62,41.46 | IC1.64 26.75,23.42 27,23.16 37.74,23.16 38,23.42 v38,23.77 | U4.3 v50.62,37.36 45.39,37.36 44.25,38.5 39.11,38.5 v38.81,38.2
  Top 0.305: U4.3
  Bottom 0.203: v38,23.77 39.01,24.79 39.01,34.95 38.61,35.36 38.61,38 v38.81,38.2 | v50.62,48.16 v50.62,43.89 | v50.62,41.46 v50.62,37.36
CAN_ENABLE  (via drill 0.3)
  Top 0.203: IC1.13 31.45,32.25 31.7,32.5 31.7,33.81 31.95,34.07 33.93,34.07 34.85,34.98 41.35,34.98 41.66,34.68 v44.5,34.68 | v68.49,20.91 68.49,18.03 U6.8
  Bottom 0.203: v68.49,20.91 68.23,21.16 44.55,21.16 44.3,21.42 44.3,34.47 v44.5,34.68
CANH  (via drill 0.3)
  Top 0.203: JP2.2 35.15,3.45 46.89,3.45 47.14,3.71 47.14,17.42 47.6,17.88 55.47,17.88 v55.68,18.09
  Top 0.254: U6.7 69.87,16.64 70.01,16.77 R10.2 | R10.2 72.93,16.76 73.44,17.27 74,17.27 | 74,17.27 R25.2 | CANBUS.1 74,17.27
  Top 0.305: R10.2
  Bottom 0.203: v55.68,18.09 55.88,17.88 60.55,17.88 62.18,16.26 71.72,16.26 R25.2
CANL  (via drill 0.3)
  Top 0.203: JP2.4 31.89,1.52 32.14,1.27 35,1.27 36.78,3.05 47.09,3.05 47.55,3.5 47.55,17.22 47.8,17.48 55.47,17.48 v55.68,17.27
  Top 0.254: U6.6 69.78,15.37 69.9,15.24 R10.1 72.95,15.24 73.46,14.73 74,14.73 | 74,14.73 R25.1 | CANBUS.2 74,14.73
  Bottom 0.203: v55.68,17.27 55.88,17.48 60.35,17.48 61.98,15.85 71.61,15.85 R25.1
CANRX  (via drill 0.3)
  Top 0.203: IC1.58 23.75,22.2 25.22,20.73 45.26,20.73 45.52,20.47 v45.52,20.12 | U6.4 65.58,14.1 65.84,14.35 v65.84,19.51
  Bottom 0.203: v45.52,20.12 45.72,20.32 62.38,20.32 62.79,19.91 65.43,19.91 v65.84,19.51
CANTX  (via drill 0.3)
  Top 0.203: IC1.57 23.25,22 24.93,20.32 44.5,20.32 v44.7,20.12 | U6.1 63.64,17.88 62.99,17.88 63.2,18.09 v63.2,20.52
  Bottom 0.203: v44.7,20.12 44.7,20.47 44.96,20.73 62.99,20.73 v63.2,20.52
ESCL1  (via drill 0.3)
  Top 0.203: v18.59,45.72 46.74,45.72 v46.94,45.52 | U5.6 51.21,28.69 51.21,31.19 51,31.39 v51,31.8 v55.5,31.8 U7.2 | ESCL1B.4 v71.93,37.49 71.93,38.81 72.14,39.01 72.14,50.22 72.39,50.47 ESCL1C.1
  Bottom 0.203: JP1.20 11.57,52.48 11.82,52.22 18.09,52.22 19,51.31 19,47.04 18.59,46.63 v18.59,45.72 | v46.94,45.52 46.94,33.17 47.4,32.72 50.95,32.72 51.21,32.46 51.21,32 v51,31.8 | ESCLA.P$2 76.59,26.42 72.94,26.42 71.96,27.39 71.93,27.39 | v71.93,37.49 71.93,27.39 | v55.5,31.8 55.83,31.8 56.08,31.55 56.08,30.02 55.93,29.87 55.93,27.65 56.19,27.39 71.93,27.39
ESDA1  (via drill 0.3)
  Top 0.203: v19.2,46.33 19.41,46.13 46.74,46.13 v46.94,46.33 | U5.5 51.72,30.08 v51.92,30.28 52.17,30.53 v55.5,30.53 U7.3 | ESCL1B.3 v72.54,36.5 | ESCL1C.2 72.8,47.93 72.54,47.67 v72.54,38.41 | v73.97,27.84 73.97,26.24 74.22,25.98 76.59,25.98 ESCLA.P$3
  Bottom 0.203: JP1.18 14.11,52.88 14.36,52.63 18.29,52.63 19.41,51.51 19.41,46.53 v19.2,46.33 | v46.94,46.33 47.3,46.33 47.55,46.08 47.55,44.91 47.35,44.7 47.35,33.38 47.6,33.12 51.16,33.12 51.71,32.56 51.71,30.48 v51.92,30.28 | ESCLA.P$3 76.59,25.98 72.72,25.98 71.71,26.99 55.96,26.99 55.5,27.45 v55.5,30.53 | v72.54,38.41 v72.54,36.5 72.54,29.72 72.8,29.46 73.71,29.46 73.97,29.21 v73.97,27.84
GND  (via drill 0.3)
  Top 0.203: C2.2 C1.2 | IC1.55 22.25,19.08 22.5,18.83 23.22,18.83 23.47,18.57 23.47,17.94 | v19.02,30.75 IC1.39 | v19.43,32.76 19.02,32.75 IC1.35 16.18,32.75 16.18,33.25 IC1.34 18.65,33.25 v19.23,33.82 19.25,33.85 IC1.32 | v30.55,27.04 30.35,27.25 IC1.3 27.4,27.25 v27.05,27.6 | IC1.12 27.19,31.75 v26.95,32 | v21.26,34.03 21.75,34.52 IC1.27 C14.2
  Top 0.254: C12.2 22.76,16.69 C8.2 23.47,17.94 C13.2 24.15,16.69 C15.2 | C16.2 21.46,39.94 21.75,39.65 C14.2
  other vias: 35.04,31.86 23.7,34.03 26.74,33.82 23.9,30.37 25.12,30.37 19.43,28.13 19.23,26.71 23.9,27.93 26.13,25.9 27.05,30.32 25.07,32.48 21.79,27.38 21.72,30.32 21.92,31.62 12.67,19.93 9.42,24.02 14.7,19.93 17.65,18.49 17.14,14.04 29.32,36.48 35.07,37.98 30.32,38.48 42.07,37.73 48.57,38.73 45.82,41.23 45.82,44.48 45.82,47.98 43.57,47.98 42.57,44.48 42.57,41.23 43.57,51.73 45.82,51.73 47.32,51.73 47.32,53.48 45.57,54.98 43.57,55.23 41.42,55.53 39.68,56.32 39.68,54.87 35.52,52.87 39.83,52.87 41.43,52.87 41.43,50.53 41.54,47.1 21.85,47.1 35.29,47.07 21.95,51.27 24.52,52.18 26.96,52.54 35.4,40.74 35.4,44.6 21.99,44.6 30.52,44.6 30.52,41.75 23.41,43.79 19.95,40.13 21.78,38.1 18.13,35.86 14.87,36.27 15.08,33.83 15.08,32.2 11.01,34.24 8.58,34.24 8.58,36.88 7.56,39.52 7.56,43.79 7.56,48.46 8.98,47.65 12.64,48.66 14.06,46.83 14.06,42.77 12.97,38.73 12.97,36.14 8.41,26.46 8.2,24.02 12.88,33.98 8,33.37 9.83,30.12 13.03,33.01 13.05,31 13.05,28.85 12.52,26.25 14.53,17.29 17.55,16.81 19.12,13.78 14.2,15.13 14.12,13.96 10.11,12.51 11.35,12.95 7.85,12.56 7.87,15.46 2.02,20.99 2.02,23.99 5.02,20.99 9.02,3.99 4.02,7.99 11.02,8.99 15.47,7.1 17.9,6.7 20.34,6.9 30.5,7.1 33.14,7.1 44.32,6.49 36.6,6.7 44.52,11.57 43.51,7.92 48.46,13.68 44.96,13.61 39.77,11.65 34.97,11.7 29.36,11.7 23.11,11.47 53.13,13.73 53.16,15.13 51.61,16.68 56.18,19.22 61.59,19.17 61.69,18.1 55.55,22.47 64.67,22.55 48.13,21.91 50.26,21.91 48.16,23.89 48.23,27.04 48.26,28.95 49.22,28.97 49.32,23.89 53.13,27.12 53.13,25.09 55.55,25.09 52.98,29.2 67,23 74,23 67,26 71,26 71,20 77,21 76,9 72,4 71,9 60.64,11.44 66.33,11.44 55.96,15.1 61.45,13.88 55.76,11.64 57.59,4.94 62.47,3.11 57.28,2.73 48.44,3.74 45.96,4.48 37.7,4.33 37,1 44,1 49,1 65,1 72,1 38.81,17.29 29.46,17.09 29.87,19.32 38.2,19.32 26.62,19.32 26.62,17.09 23.62,20.31 30.05,24.5 35.53,26.43 35.53,24.6 37.56,25.82 41.42,33.35 41.45,30.23 8,55.98 4,51.98 9,51.98 13.61,50.98 17.68,50.98 6.3,51.39 3,45.98 3,37.98 13.61,11.15 10.16,15.02 11.99,15.02 46.2,27.04 46.2,23.99 46.4,29.07 46.4,32.12 54.73,37.2 52.09,41.67 53.72,43.7 56.77,42.69 58.19,45.13 61.44,44.31 64.69,44.92 68.76,45.13 68.96,48.58 64.89,48.78 62.46,48.58 57.38,49.39 52.09,48.38 53.31,50 57,58 44,58 51,58 72,56 78,52 72,52 72,58 66,52 69,52 65.8,55.66 69.45,55.45 61,59 66,59 16.86,25.04 45.08,21.91 34.88,33.71 67.9,37.15 68.08,29.48 57.56,36.08 63.61,35.98 60.13,22.57 74.16,40.54 78.33,41.28 37.01,54.69 73.43,49.26 73.73,46.74 73.73,43.85 71.04,44.71 71.09,48.55 71.07,41.15 70.86,36.4 68.55,41.61 62.51,41.43 54.28,54.72 58.34,51.98 48.9,34.92 52.05,34.94 49.38,31.41
  pour Bottom (isolate 0.254): 0,60 0,0 80,0 80,60
  pour Top (isolate 0.254): 0,60 0,0 80,0 80,60
GPI0  (via drill 0.3)
  Top 0.203: JP1.3 30.62,56 30.62,52.1 30.87,51.85 37.39,51.85 37.59,52.05 39.8,52.05 v40.03,51.82 | IC1.61 25.25,22.81 26.11,21.95 39.98,21.95 40.23,22.2 v40.23,22.76
  Bottom 0.203: v40.03,51.82 40.23,51.61 v40.23,22.76
GPI1  (via drill 0.3)
  Top 0.203: v30.79,32.95 30.58,32.75 IC1.14
  Bottom 0.203: v30.79,32.95 30.99,32.75 35.51,32.75 35.76,33 35.76,34.68 36.58,35.49 36.58,47.99 33.12,51.44 33.12,52.58 32.87,52.83 28.38,52.83 28.08,53.13 28.08,56 JP1.5
GPI2  (via drill 0.3)
  Top 0.203: v38.41,27.57 38.22,27.75 IC1.4 | JP1.7 25.54,56 25.54,51.7 25.8,51.44 v37.95,51.44
  Bottom 0.203: v38.41,27.57 38.61,27.77 38.61,34.75 38.2,35.15 38.2,51.19 v37.95,51.44
GPI3  (via drill 0.3)
  Top 0.203: JP1.9 23,56 23,51.29 23.25,51.03 37.39,51.03 37.62,50.8 v39.62,50.8 | IC1.62 25.75,23.01 26.41,22.35 39.37,22.35 39.62,22.61 v39.62,23.37
  Bottom 0.203: v39.62,50.8 39.62,50.43 39.83,50.22 39.83,24.38 39.62,24.18 v39.62,23.37
GPO0  (via drill 0.3)
  Top 0.203: IC1.28 21.25,37.17 20.39,38.03 18.97,38.03 v18.75,38.25 | JP1.11 20.46,56 20.46,53.26 20.21,53 17.67,53 16.2,51.53 16.2,38.28 16.45,38.03 17.2,38.03 v17.42,38.25
  Bottom 0.203: v17.42,38.25 v18.75,38.25
GPO1
  Top 0.203: IC1.29 20.75,36.96 20.09,37.62 18.09,37.62 | JP1.13 17.92,56 17.92,53.94 15.79,51.81 15.79,38.08 16.25,37.62 18.09,37.62 | SJ3.3 18.09,37.62
GPO2
  Top 0.203: IC1.30 20.25,36.76 19.79,37.22 16.04,37.22 15.38,37.88 15.38,56 JP1.15
GPO3
  Top 0.203: IC1.31 19.75,36.56 19.5,36.81 15.81,36.81 14.95,37.67 14.95,51.89 12.84,53.99 12.84,56 JP1.17
LED_OUT  (via drill 0.3)
  Top 0.203: LEDS.2 12.32,14 12.95,14.63 12.95,16.46 | 12.95,16.46 12.95,18.19 12.64,18.5 U8.4 | v16.26,16.46 12.95,16.46
  Bottom 0.203: JP2.10 22.96,4.04 22.96,9.78 16.05,9.78 16.05,16.26 v16.26,16.46
N$1
  Top 0.305: U3.4 55.68,45.1 C19.1
N$2
  Top 0.203: R5.1 JTAG.1
N$4
  Top 0.203: R3.2 R4.1 65.84,7.98 | RST.P$2 68,8.23 67.75,7.98 65.84,7.98 | C6.1 65.58,10.41 65.84,10.16 65.84,7.98
N$7
  Top 0.203: R21.1 55.47,33.33 55.73,33.07 U7.1
N$8
  Top 0.203: USB.4 6.25,29.34 6.5,29.09 6.5,26.75 5.89,26.14 R1.2
N$9
  Top 0.203: R9.1 50.22,30.11 | 50.22,30.11 U5.8 | U5.7 50.72,29.86 50.46,30.11 50.22,30.11
N$10  (via drill 0.3)
  Top 0.203: v54.37,29.26 U7.4 | R16.1 v54.05,32.72
  Bottom 0.203: v54.05,32.72 54.05,29.58 v54.37,29.26
N$11
  Top 0.305: R24.2 S2V8.A
N$12
  Top 0.305: U2.4 C24.1
N$13
  Top 0.305: S3V3.A R11.2
N$14
  Top 0.305: U4.4 C26.1
N$15
  Top 0.305: R13.2 S50V.A
N$16  (via drill 0.3)
  Top 0.203: SJ3.2 v19.51,41.66 | v11.38,15.9 11.12,16.15 U8.2
  Bottom 0.203: v19.51,41.66 14.45,41.66 13.82,41.02 13.82,16.22 13.5,15.9 v11.38,15.9
N$17
  Top 0.203: C22.1 8.63,40.77 8.88,40.51 U1.4
N$20
  Top 0.305: D1.A 62.69,54 61.59,52.9 Q3.3
N$21
  Top 0.305: R15.1 60.95,57 | 60.95,57 R12.2 | Q3.1 60.95,57
N$24
  Top 0.305: D2.A 62.8,47 61.7,45.9 Q4.3
N$25
  Top 0.305: R18.1 60.95,50 | 60.95,50 R17.2 | Q4.1 60.95,50
N$28
  Top 0.305: D3.A 62.91,40 61.81,38.9 Q5.3
N$29
  Top 0.305: R20.1 60.95,43 | 60.95,43 R19.2 | Q5.1 60.95,43
ONEWIRE  (via drill 0.3)
  Top 0.203: v25.54,10.8 25.74,10.6 40.79,10.6 41.05,10.85 41.05,16.29 40.44,16.9 v40.44,17.3 | IC1.59 24.25,22.4 25.52,21.13 40.64,21.13 v40.84,21.34
  Bottom 0.203: JP2.8 25.54,4 v25.54,10.8 | v40.44,17.3 40.44,18.22 41.05,18.83 41.05,21.13 v40.84,21.34
OSC0
  Top 0.203: IC1.40 11.25,30.25 11,30.5 11,32.04 | 11,32.04 Y2.1 | C4.2 11,32.04
OSC1
  Top 0.203: IC1.41 11.25,29.75 11,29.5 11,28.38 | 11,28.38 Y2.2 | C5.2 11,28.38
PB0
  Top 0.203: IC1.45 15.7,27.75 14.83,26.89 14.83,22.84 14.17,22.18 6.55,22.18 5.89,22.84 R1.1
PB1
  Top 0.203: IC1.46 15.9,27.25 15.24,26.59 15.24,22.07 14.38,21.2 R2.2
PB2  (via drill 0.3)
  Top 0.203: IC1.47 16.1,26.75 15.65,26.29 15.65,20.96 v15.44,20.76 | SJ1.1 21.48,8.41 21.73,8.15 JP2.11
  Bottom 0.203: JP2.11 21.73,9.12 21.48,9.38 15.9,9.38 15.65,9.63 15.65,20.55 v15.44,20.76
PB3  (via drill 0.3)
  Top 0.203: IC1.48 16.31,26.25 16.05,26 16.05,19.34 v15.04,18.32 | SJ2.1 v14.99,11.61
  Bottom 0.203: JP2.13 19.19,8.72 18.94,8.97 15.7,8.97 15.24,9.43 15.24,11.21 14.99,11.46 v14.99,11.61 14.99,11.82 15.24,12.07 15.24,18.12 v15.04,18.32
PD7  (via drill 0.3)
  Top 0.203: JP2.17 14.11,9.94 14.36,10.19 21.54,10.19 | 21.54,10.19 41,10.19 41.45,10.65 41.45,16.49 41.05,16.9 v41.05,17.91 | SJ2.2 21.29,11.61 21.54,11.36 21.54,10.19 | v41.66,29.09 41.3,29.09 40.89,28.68 38,28.68 v37.8,28.89 | IC1.10 35.59,30.75 v35.76,30.92
  Bottom 0.203: v41.05,17.91 41.05,18.22 41.45,18.62 41.45,27.57 41.05,27.97 41.05,28.84 41.3,29.09 v41.66,29.09 | v37.8,28.89 v35.76,30.92
PF4  (via drill 0.3)
  Top 0.203: JP2.15 16.65,8.41 | 16.65,8.41 16.65,9.53 16.9,9.79 41.2,9.79 41.86,10.45 41.86,16.69 41.66,16.9 v41.66,17.3 | SJ1.2 16.65,8.41 | IC1.5 v41.66,28.25
  Bottom 0.203: v41.66,17.3 41.66,18.22 41.86,18.42 41.86,28.05 v41.66,28.25
PSEL_2V8  (via drill 0.3)
  Top 0.203: IC1.63 26.25,23.22 26.71,22.76 38.56,22.76 38.81,23.01 v38.81,23.57 | v39.27,53.75 45.92,53.75 v46.74,54.56
  Top 0.305: R19.1 v64.48,43 R24.1
  Bottom 0.203: v38.81,23.57 38.81,23.98 39.42,24.59 39.42,49.99 39.01,50.39 39.01,53.49 v39.27,53.75 | v64.48,43 63.6,43.88 63.6,50.39 64.01,50.8 64.01,55.22 63.75,55.47 47.65,55.47 v46.74,54.56
PSEL_3V3  (via drill 0.3)
  Top 0.203: IC1.53 21.25,19.25 20.62,18.62 20.62,14.02 v20.83,13.82 | v44.09,13.82 43.89,14.02 43.89,15.95 44.7,16.76 v44.7,17.88
  Top 0.305: R11.1 v64.49,50 R17.1
  Bottom 0.203: v20.83,13.82 21.03,14.02 43.89,14.02 v44.09,13.82 | v44.7,17.88 44.7,18.19 43.89,19 43.89,34.95 44.6,35.66 44.6,55.56 44.92,55.88 64.03,55.88 64.49,55.42 v64.49,50
PSEL_5V  (via drill 0.3)
  Top 0.203: IC1.60 24.75,22.61 25.82,21.54 40.23,21.54 v40.84,22.15
  Top 0.305: R12.1 v64.49,57 R13.1
  Bottom 0.203: v40.84,22.15 41.05,22.35 41.05,27.36 40.64,27.77 40.64,55.97 40.96,56.29 63.78,56.29 v64.49,57
PULL_OPEN  (via drill 0.3)
  Top 0.203: U7.13 60.67,31.8 60.35,31.48 60.35,28.31 60.03,27.99 U7.5 v54.3,27.99 | IC1.9 32.38,30.25 36.12,30.25 36.58,30.7 36.58,32.34 36.17,32.75 36.17,34.17 36.54,34.54 41.15,34.54 41.45,34.24 43.59,34.24 44.5,33.33 v45.72,33.33
  Bottom 0.203: v45.72,33.33 45.52,33.12 45.52,28.25 45.77,27.99 v54.3,27.99
PWM1  (via drill 0.3)
  Top 0.203: JP2.6 28.08,4 v28.08,8.08 | IC1.1 v28.6,25.18 | v28.08,11.25 28.08,18.89 v28.6,19.41
  Bottom 0.203: v28.08,8.08 v28.08,11.25 | v28.6,25.18 v28.6,19.41
RST  (via drill 0.3)
  Top 0.203: IC1.38 v16.04,31.25 | v48.56,5.67 49.46,5.67 JTAG.10 v49.46,2.65 | R4.2 PROG.6
  Bottom 0.203: v48.56,5.67 50.14,5.67 50.39,5.93 50.39,14.21 50.14,14.46 19.76,14.46 18.69,15.53 18.69,18.52 15.64,21.58 15.64,30.84 v16.04,31.25 | PROG.6 63.35,9 63.6,8.75 63.6,2.27 63.35,2.02 50.09,2.02 v49.46,2.65
RX0  (via drill 0.3)
  Top 0.203: JP2.3 31.89,7.91 32.14,8.16 42.01,8.16 43.48,9.63 43.48,16.29 44.09,16.9 v44.09,17.3 | v43.89,36.25 43.64,36.51 41.55,36.51 41.25,36.2 34.24,36.2 33.33,35.29 28.35,35.29 28.03,35.6 IC1.17
  Bottom 0.203: v44.09,17.3 44.09,18.22 43.48,18.83 43.48,35.08 43.69,35.29 43.69,36.05 v43.89,36.25
RX1  (via drill 0.3)
  Top 0.203: JP2.7 26.81,8.72 27.06,8.97 41.6,8.97 42.67,10.04 42.67,16.69 42.88,16.9 v42.88,17.3 | v42.67,35.85 42.42,36.1 41.76,36.1 41.45,35.8 34.44,35.8 33.53,34.88 28.85,34.88 28.6,34.63 IC1.16
  Bottom 0.203: v42.88,17.3 42.88,18.22 42.67,18.42 v42.67,35.85
S2V8
  Top 0.305: U4.5 C27.1 55.46,40.85 55.71,41.1 Q5.2 59.05,42.06 59.29,42.3 R20.2
S3V3
  Top 0.305: U3.5 C25.1 55.43,47.85 55.68,48.1 Q4.2 59.05,49.06 59.29,49.3 R18.2
S50
  Top 0.305: U2.5 53.23,53.92 C20.1 55.45,54.85 55.71,55.1 Q3.2 59.05,56.06 59.29,56.3 R15.2
SCL1  (via drill 0.3)
  Top 0.203: U5.3 v51.22,22.43 R23.2 | IC1.23 23.75,37.54 26.24,40.03 30.48,40.03 31.29,39.22 45.31,39.22 v45.52,39.01
  Bottom 0.203: v51.22,22.43 51.02,22.64 45.16,22.64 44.7,23.09 44.7,33.93 45.31,34.54 45.31,38.81 v45.52,39.01
SDA1  (via drill 0.3)
  Top 0.203: U5.4 51.72,23.85 | R22.2 51.72,23.85 | 51.72,23.85 51.72,23.14 v51.82,23.04 | IC1.24 23.25,37.78 25.91,40.44 30.68,40.44 31.46,39.66 v45.97,39.66
  Bottom 0.203: v45.97,39.66 46.13,39.5 46.13,38.69 45.72,38.28 45.72,34.34 45.11,33.73 45.11,23.3 45.36,23.04 v51.82,23.04
SSI0CLK  (via drill 0.3)
  Top 0.203: IC1.19 25.75,36.73 26.21,37.19 28.6,37.19 29.26,37.85 v29.26,39.22
  Bottom 0.203: JP1.10 24.27,53.32 24.02,53.07 22.35,53.07 21.03,51.75 21.03,42.96 21.29,42.7 28.19,42.7 29.06,41.84 29.06,39.83 29.26,39.62 v29.26,39.22
SSI0FSS  (via drill 0.3)
  Top 0.203: IC1.20 25.25,36.93 25.91,37.59 28.19,37.59 28.65,38.05 v28.65,38.61
  Bottom 0.203: JP1.12 21.73,53.05 20.62,51.95 20.62,42.76 21.08,42.3 27.99,42.3 28.65,41.64 v28.65,38.61
SSI0RX  (via drill 0.3)
  Top 0.203: IC1.21 24.75,37.13 25.61,38 27.79,38 28.04,38.25 v28.04,39.22
  Bottom 0.203: JP1.14 19.19,52.98 20.22,51.95 20.22,42.55 20.88,41.89 27.79,41.89 28.25,41.43 28.25,39.83 28.04,39.62 v28.04,39.22
SSI0TX  (via drill 0.3)
  Top 0.203: IC1.22 24.25,37.34 25.32,38.41 27.23,38.41 v27.43,38.61 | SJ3.1 18.09,44.3 v18.59,44.81
  Bottom 0.203: JP1.16 16.65,53.32 16.9,53.07 18.49,53.07 19.81,51.75 19.81,44.81 | 19.81,44.81 19.81,42.35 20.68,41.48 27.58,41.48 27.84,41.23 27.84,40.03 27.43,39.62 v27.43,38.61 | v18.59,44.81 19.81,44.81
TCK  (via drill 0.3)
  Top 0.203: IC1.52 20.75,23.09 20.34,22.69 v20.34,22.08 R7.2 | JTAG.4 v53.27,3.85 53.27,3.49 53.52,3.23 54.86,3.23 55.07,3.44 59.8,3.44 v60,3.23
  Bottom 0.203: v20.34,22.08 20.34,16.34 20.6,16.09 50.95,16.09 52.02,15.02 52.02,3.9 52.27,3.64 53.07,3.64 v53.27,3.85 | PROG.3 v60,3.23
TDI  (via drill 0.3)
  Top 0.203: IC1.50 19.75,23.35 19.29,22.89 v18.8,22.89 | v50.73,4.05 JTAG.8
  Bottom 0.203: v18.8,22.89 18.49,22.59 18.49,19.95 19.51,18.93 19.51,15.93 20.17,15.27 50.55,15.27 51.21,14.61 51.21,4.93 50.73,4.45 v50.73,4.05 50.73,3.92 51.82,2.83 55.83,2.83 56.08,3.08 56.08,10.3 56.34,10.55 59.75,10.55 60,10.3 PROG.4
TDO  (via drill 0.3)
  Top 0.203: IC1.49 18.65,24.4 17.86,23.6 v17.86,22.08 R8.1 | v50.24,3.23 51.75,3.23 52,3.49 JTAG.6
  Bottom 0.203: v17.86,22.08 17.86,19.97 19.1,18.73 19.1,15.73 19.96,14.87 50.34,14.87 50.8,14.41 50.8,5.27 49.99,4.45 49.99,3.49 v50.24,3.23 50.8,3.23 51.61,2.42 56.03,2.42 56.49,2.88 56.49,8.75 56.74,9 PROG.2
TMS  (via drill 0.3)
  Top 0.203: R6.2 v19.1,22.08 20.25,23.23 IC1.51 | JTAG.2 v54.54,3.85 61.75,3.85 62,4.1 PROG.5
  Bottom 0.203: v19.1,22.08 19.1,19.95 19.91,19.13 19.91,16.14 20.37,15.68 50.75,15.68 51.61,14.81 51.61,3.69 52.07,3.23 54.29,3.23 54.54,3.49 v54.54,3.85
TX0  (via drill 0.3)
  Top 0.203: JP2.5 29.35,8.31 29.6,8.57 41.81,8.57 43.08,9.84 43.08,16.49 43.48,16.9 v43.48,17.91 | v43.28,37.12 43.08,36.91 41.35,36.91 41.05,36.61 34.04,36.61 33.12,35.69 28.52,35.69 27.43,36.78 26.5,36.78 26.25,36.52 IC1.18
  Bottom 0.203: v43.48,17.91 43.48,18.22 43.08,18.62 43.08,35.29 43.28,35.49 v43.28,37.12
TX1  (via drill 0.3)
  Top 0.203: IC1.15 29.82,33.25 30.07,33.5 30.07,34.22 30.33,34.47 33.73,34.47 34.65,35.39 v41.96,35.39 | v42.27,17.91 42.27,10.24 41.4,9.38 24.52,9.38 24.27,9.12 JP2.9
  Bottom 0.203: v41.96,35.39 42.27,35.08 v42.27,17.91
USB0VBUS
  Top 0.406: USB.1 6.15,31.29 6.4,31.54 F1.2
USB05V  (via drill 0.3)
  Top 0.203: v9,21.2 R2.1
  Top 0.254: U1.3 9.91,44.35 10.17,44.61 11.81,44.61
  Top 0.406: U1.1 11.81,44.61 11.81,45.59 C18.1 11.7,45.8 C21.1 v11.7,49.58 | U2.1 48.99,53.87 v48.67,53.56 | U3.1 v48.67,47 | v48.67,40.44 48.99,40.12 U4.1 | F1.1 v6.4,38.03 | U8.5 9.32,18.5 9,18.82 9,19.91 | 9,19.91 v9,21.2 | CL1.2 9,19.91 | v16.87,12.8 v13.21,12.8 | v49.17,12.8 52.6,16.23 57.51,16.23 | U6.3 61.24,15.37 60.38,16.23 59.54,16.23 | 57.51,16.23 59.54,16.23 | C28.1 57.51,16.23 | C30.1 59.54,16.23 | v17.17,49.58 v48.67,49.58
  Bottom 0.406: v48.67,53.56 v48.67,49.58 v48.67,47 v48.67,40.44 | v17.17,49.58 v11.7,49.58 7.04,49.58 6.4,48.95 v6.4,38.03 6.4,21.84 7.04,21.2 v9,21.2 9,11.46 | 9,11.46 LEDS.3 | 9,11.46 11.87,11.46 v13.21,12.8 | v16.87,12.8 v49.17,12.8
USB_DM
  Top 0.203: USB.2 6.66,30.64 7.32,29.98 7.32,23.25 7.57,22.99 13.77,22.99 14.02,23.25 14.02,27.48 15.29,28.75 IC1.43
USB_DP
  Top 0.203: USB.3 6.45,29.99 6.91,29.53 6.91,23.04 7.37,22.59 13.97,22.59 14.43,23.04 14.43,27.18 15.49,28.25 IC1.44
VDCC
  Top 0.203: 22.85,39.25 C14.1
  Top 0.254: IC1.56 22.75,19.65 23.07,19.34 24.85,19.34 25.17,19.02 C13.1 25.17,16.69 C15.1 | IC1.25 C14.1 | C14.1 22.85,39.25 | C16.1 22.99,39.96 22.75,39.72 C14.1
  Top 0.305: IC1.56 IC1.25
VEXTERN  (via drill 0.3)
  Top 0.305: D1.C v70,54 | v70,47 D2.C | v70,40 D3.C | JP2.1 45.09,5.27 45.72,5.91 45.72,17.68 47.27,19.23 R9.2 47.27,35.85 47.59,36.17 v54.05,36.17 R16.2 R21.2 | ESCL1B.2 72.14,35.5 | 72.14,35.5 70,35.5 v70,40 | C32.1 72.14,35.5 | 72.14,29.08 76.75,29.08 77,28.82 ESCLA.P$1 | 72.14,29.08 70.51,29.08 70,29.59 v70,40 | C31.1 72.14,29.08
  Bottom 0.305: v70,54 v70,47 | v70,47 v70,40 56.17,40 55.85,39.68 55.85,36.49 55.53,36.17 v54.05,36.17 | v70,47 71.57,47 73.18,45.39 ESCL1C.3

### Text on the board
tNames: GND | GPO3 | GPO2 | GPO1 | GPO0 | GPI3 | GPI2 | GPI1 | GPI0 | 3V3 | ESCL1 | ESDA1 | S0TX | S0RX | S0FSS | S0CLK | GND | ADC2 | ADC1 | ADC0 | CANH | /home/can/Downloads/mm-icon.bmp | GND | PD7 | PF4 | PB3 | PB2 | TX1 | RX1 | TX0 | RX0 | GND | CANL | GND | GND | GND | GND | GND | LOUT | OWIRE | PWM1 | CANL | CANH